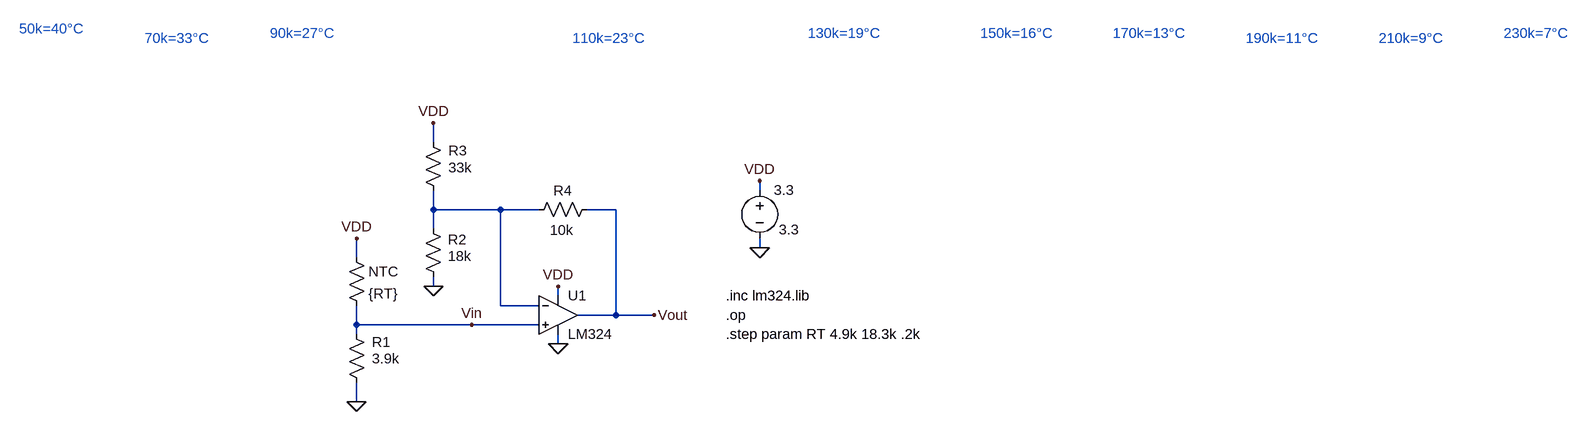
[diagram p0: schematic temperatura.asc]
temperatura.asc, the LTspice schematic file:
Version 4
SHEET 1 3272 680
WIRE 1168 -48 1168 -80
WIRE 1712 32 1712 16
WIRE 1168 64 1168 32
WIRE 1280 64 1168 64
WIRE 1344 64 1280 64
WIRE 1472 64 1424 64
WIRE 1168 96 1168 64
WIRE 1712 128 1712 112
WIRE 1040 144 1040 112
WIRE 1168 192 1168 176
WIRE 1376 208 1376 192
WIRE 1280 224 1280 64
WIRE 1344 224 1280 224
WIRE 1472 240 1472 64
WIRE 1472 240 1408 240
WIRE 1536 240 1472 240
WIRE 1040 256 1040 224
WIRE 1232 256 1040 256
WIRE 1344 256 1232 256
WIRE 1040 272 1040 256
WIRE 1376 288 1376 272
WIRE 1040 384 1040 352
FLAG 1712 128 0
FLAG 1712 16 VDD
FLAG 1376 192 VDD
FLAG 1536 240 Vout
FLAG 1376 288 0
FLAG 1168 -80 VDD
FLAG 1168 192 0
FLAG 1040 384 0
FLAG 1040 112 VDD
FLAG 1232 256 Vin
SYMBOL voltage 1712 16 R0
WINDOW 123 0 0 Left 0
WINDOW 39 0 0 Left 0
WINDOW 3 32 82 Left 2
SYMATTR InstName 3.3
SYMATTR Value 3.3
SYMBOL Opamps\\opamp2 1376 176 R0
SYMATTR InstName U1
SYMATTR Value LM324
SYMBOL res 1024 256 R0
WINDOW 0 42 29 Left 2
WINDOW 3 42 57 Left 2
SYMATTR InstName R1
SYMATTR Value 3.9k
SYMBOL res 1152 80 R0
WINDOW 0 40 34 Left 2
WINDOW 3 40 62 Left 2
SYMATTR InstName R2
SYMATTR Value 18k
SYMBOL res 1152 -64 R0
WINDOW 0 41 30 Left 2
WINDOW 3 41 58 Left 2
SYMATTR InstName R3
SYMATTR Value 33k
SYMBOL res 1440 48 R90
WINDOW 0 0 56 VBottom 2
WINDOW 3 66 58 VBottom 2
SYMATTR InstName R4
SYMATTR Value 10k
SYMBOL res 1024 128 R0
SYMATTR InstName NTC
SYMATTR Value {RT}
TEXT 1656 272 Left 2 !.step param RT 4.9k 18.3k .2k
TEXT 1656 240 Left 2 !.op
TEXT -416 -336 Left 2 ;50k=40°C
TEXT 288 -320 Left 2 ;70k=33°C
TEXT 896 -328 Left 2 ;90k=27°C
TEXT 1400 -320 Left 2 ;110k=23°C
TEXT 1792 -328 Left 2 ;130k=19°C
TEXT 2128 -328 Left 2 ;150k=16°C
TEXT 2432 -328 Left 2 ;170k=13°C
TEXT 2704 -320 Left 2 ;190k=11°C
TEXT 2944 -320 Left 2 ;210k=9°C
TEXT 3152 -328 Left 2 ;230k=7°C
TEXT 1656 208 Left 2 !.inc lm324.lib

The netlist it stands for:
* temperatura.asc
V§3.3 VDD 0 3.3
XU1 Vin N001 VDD 0 Vout LM324  ; pins In+ In- V+ V- OUT
R1 Vin 0 3.9k
R2 N001 0 18k
R3 VDD N001 33k
R4 Vout N001 10k
R§NTC VDD Vin {RT}
.step param RT 4.9k 18.3k .2k
.op
* 50k=40°C
* 70k=33°C
* 90k=27°C
* 110k=23°C
* 130k=19°C
* 150k=16°C
* 170k=13°C
* 190k=11°C
* 210k=9°C
* 230k=7°C
.inc lm324.lib
.backanno
.end